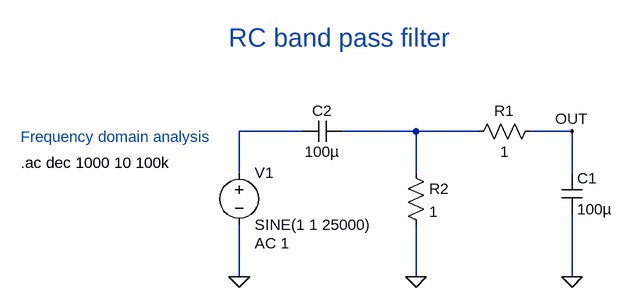
[diagram p0: schematic RC-bandpass-filter-frequency-domain.asc]
RC-bandpass-filter-frequency-domain.asc, the LTspice schematic file:
Version 4
SHEET 1 880 680
WIRE 176 48 80 48
WIRE 352 48 240 48
WIRE 448 48 352 48
WIRE 592 48 528 48
WIRE 80 112 80 48
WIRE 352 112 352 48
WIRE 592 112 592 48
WIRE 80 272 80 192
WIRE 352 272 352 192
WIRE 592 272 592 176
FLAG 80 272 0
FLAG 352 272 0
FLAG 592 272 0
FLAG 592 48 OUT
SYMBOL voltage 80 96 R0
WINDOW 123 24 124 Left 2
WINDOW 39 0 0 Left 2
SYMATTR Value2 AC 1
SYMATTR InstName V1
SYMATTR Value SINE(1 1 25000)
SYMBOL res 544 32 R90
WINDOW 0 0 56 VBottom 2
WINDOW 3 32 56 VTop 2
SYMATTR InstName R1
SYMATTR Value 1
SYMBOL cap 576 112 R0
SYMATTR InstName C1
SYMATTR Value 100µ
SYMBOL cap 240 32 R90
WINDOW 0 0 32 VBottom 2
WINDOW 3 32 32 VTop 2
SYMATTR InstName C2
SYMATTR Value 100µ
SYMBOL res 336 96 R0
SYMATTR InstName R2
SYMATTR Value 1
TEXT -256 96 Left 2 !.ac dec 1000 10 100k
TEXT 64 -96 Left 4 ;RC band pass filter
TEXT -256 56 Left 2 ;Frequency domain analysis

The netlist it stands for:
* RC-bandpass-filter-frequency-domain.asc
V1 N001 0 SINE(1 1 25000) AC 1
R1 OUT N002 1
C1 OUT 0 100µ
C2 N002 N001 100µ
R2 N002 0 1
.ac dec 1000 10 100k
* RC band pass filter
* Frequency domain analysis
.backanno
.end